# EAGLE schematic XL6009 (EAGLE 9.5.2)
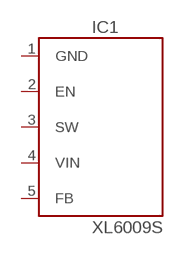
[diagram p0: schematic, sheet 1]

## Parts
IC1  XL6009S  [TO263-5]
Unconnected: IC1.1(GND) IC1.2(EN) IC1.5(FB)

## Power pins joined to a net without a drawn wire
SW: IC1.3(SW)
VIN: IC1.4(VIN)

## Library data of the parts
IC1 = XL6009-TO263:XL6009: XL6009. 400KHz 60V 4A Switching Current Boost / Buck-Boost / Inverting DC/DC Converter. Created By: Manash Jyoti Deka. Github: https://github.com/mjdeka